# Altium project ESP32_eksperiment.PrjPcb
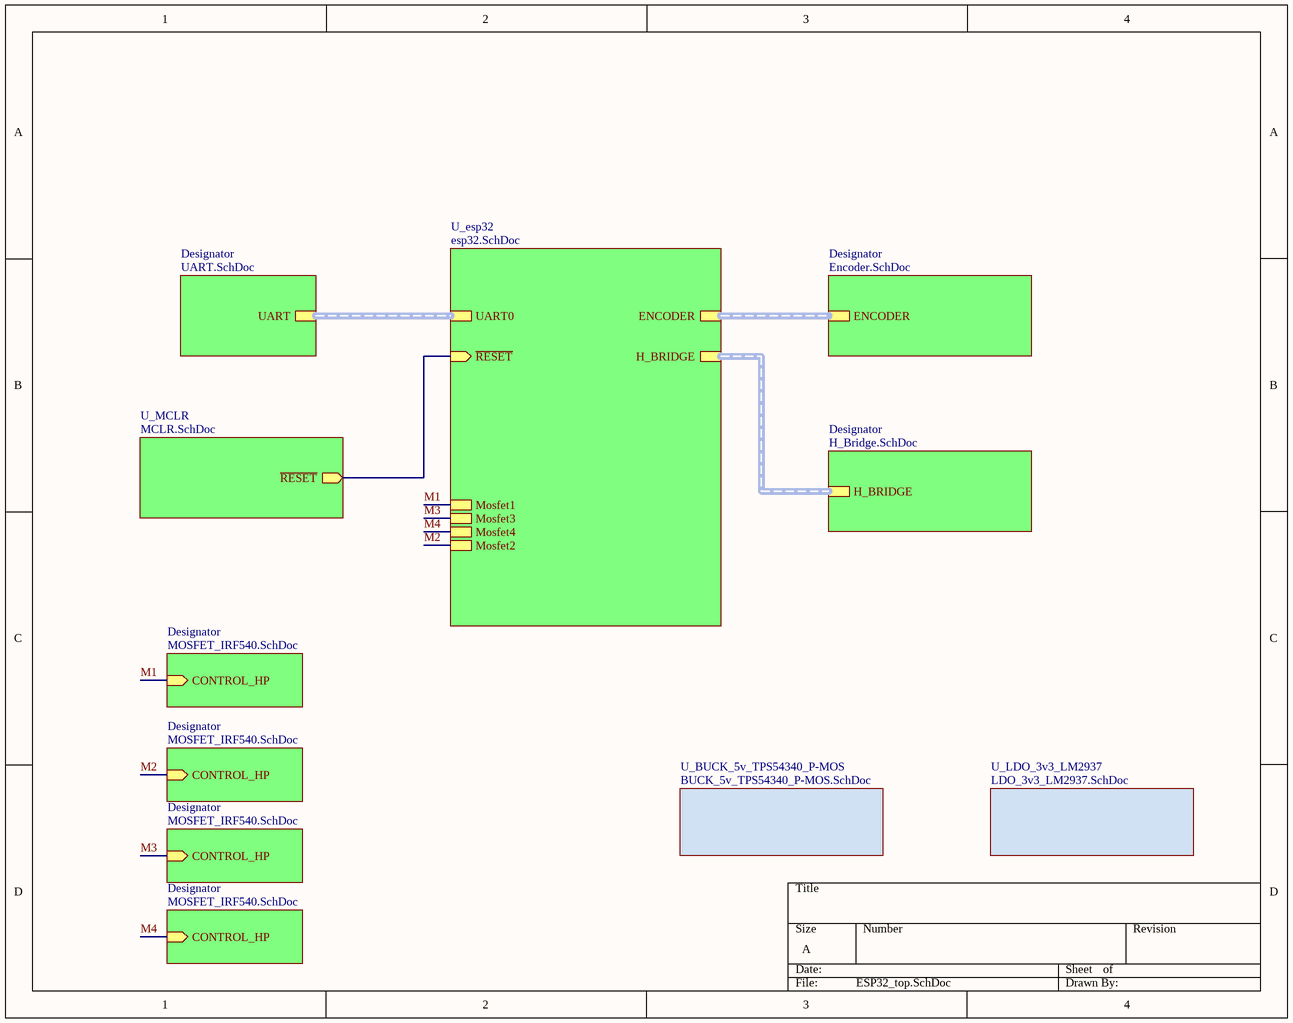
[diagram p0: ESP32_top.SchDoc]
9 sheets, 89 parts. Net scope: hierarchical (ports join the sheet entries above them; power ports are global).
Sheets:
  ESP32_top.SchDoc
    Designator = UART.SchDoc
    U_MCLR = MCLR.SchDoc
    U_LDO_3v3_LM2937 = LDO_3v3_LM2937.SchDoc
    U_BUCK_5v_TPS54340_P-MOS = BUCK_5v_TPS54340_P-MOS.SchDoc
    U_esp32 = esp32.SchDoc
    Designator = Encoder.SchDoc
    Designator = H_Bridge.SchDoc
    Designator = MOSFET_IRF540.SchDoc
    Designator = MOSFET_IRF540.SchDoc
    Designator = MOSFET_IRF540.SchDoc
    Designator = MOSFET_IRF540.SchDoc

## Sheet ESP32_top.SchDoc
size A; SheetNumber: 1; SheetTotal: 9

### Sub-sheets
Designator = UART.SchDoc: UART (harness Conn.UART)
Designator = Encoder.SchDoc: ENCODER (harness conn. encoder)
Designator = H_Bridge.SchDoc: H_BRIDGE (harness conn.h_bridge)
Designator = MOSFET_IRF540.SchDoc: CONTROL_HP (in)
Designator = MOSFET_IRF540.SchDoc: CONTROL_HP (in)
Designator = MOSFET_IRF540.SchDoc: CONTROL_HP (in)
Designator = MOSFET_IRF540.SchDoc: CONTROL_HP (in)
U_BUCK_5v_TPS54340_P-MOS = BUCK_5v_TPS54340_P-MOS.SchDoc: no entries
U_esp32 = esp32.SchDoc: UART0 (harness esp.32 UART), ENCODER (harness esp32. encoder), ~{RESET} (in), H_BRIDGE (harness esp32. h_bridge), Mosfet1, Mosfet3, Mosfet4, Mosfet2
U_LDO_3v3_LM2937 = LDO_3v3_LM2937.SchDoc: no entries
U_MCLR = MCLR.SchDoc: ~{RESET} (out)

### Nets
M1: sheet U_esp32/Mosfet1, sheet Designator/CONTROL_HP
M2: sheet U_esp32/Mosfet2, sheet Designator/CONTROL_HP
M3: sheet U_esp32/Mosfet3, sheet Designator/CONTROL_HP
M4: sheet U_esp32/Mosfet4, sheet Designator/CONTROL_HP
Net?_3: sheet U_MCLR/~{RESET}, sheet U_esp32/~{RESET}

### Buses and harness runs
harness sheet Designator/ENCODER = sheet U_esp32/ENCODER
harness sheet Designator/H_BRIDGE = sheet U_esp32/H_BRIDGE
harness sheet Designator/UART = sheet U_esp32/UART0

## Sheet UART.SchDoc
size A; SheetNumber: 7; SheetTotal: 9
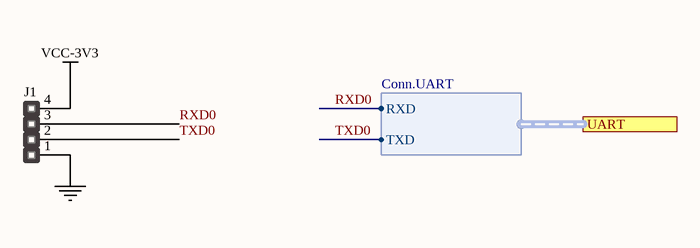
[diagram p1: UART.SchDoc]

### Parts
J1  HEADER_1x4  [HM1X4]  (value not drawn)

### Ports
UART (harness Conn.UART)

### Harnesses
Conn.UART: RXD, TXD

### Nets
GND: J1.1
VCC-3V3: J1.4
RXD0: J1.3 ; port UART.RXD  [project net RXD]
TXD0: J1.2 ; port UART.TXD  [project net TXD]

## Sheet MCLR.SchDoc
size A; SheetNumber: 3; SheetTotal: 7
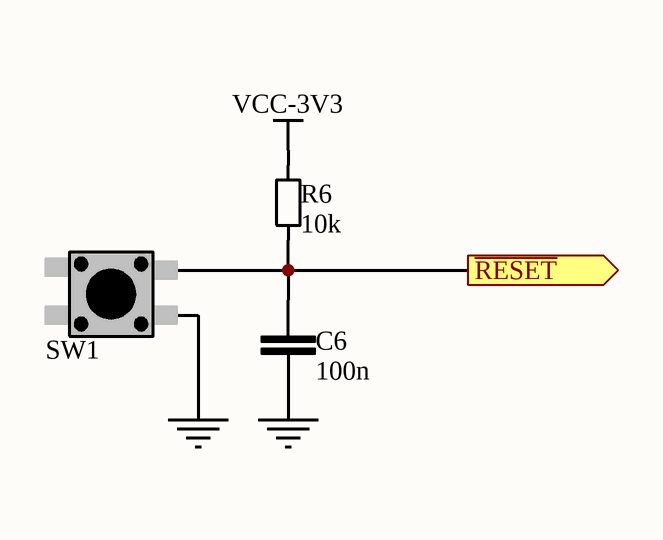
[diagram p2: MCLR.SchDoc]

### Parts
C6  100n  [CER_0603]
R6  10k  [RESC2013X38N-0805-NOOVERLAY]
SW1  TASTER  [TASTER_SMD]  (value not drawn)

### Ports
~{RESET} (out)

### Nets
GND: C6.1 SW1.1
VCC-3V3: R6.2
Net?_3: C6.2 R6.1 SW1.2 ; port ~{RESET}

### Library data of the parts
C6 = 06032105: CAP CER 100n 10V X5R 10% 0603; Capacitance: 100n
R6 = 000001002: RES SMD 10 kOhm 1/8W 0805; Resistance: 10k

## Sheet LDO_3v3_LM2937.SchDoc
size A; SheetNumber: 2; SheetTotal: 6
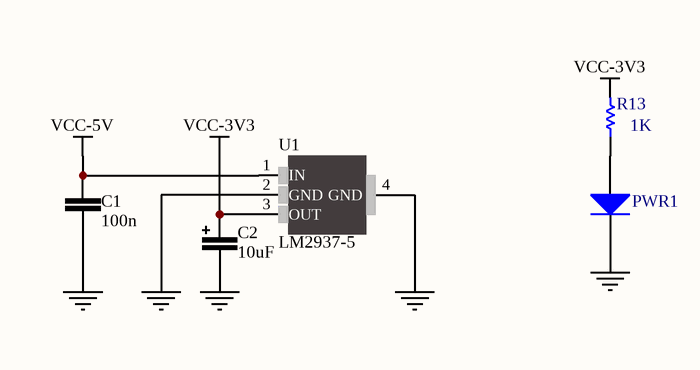
[diagram p3: LDO_3v3_LM2937.SchDoc]

### Parts
C1  100n  [CER_0603]
C2  10uF  [TANT_1210]
PWR1  (no value)  [SMC]
R13  value 1K  [AXIAL-0.3]
U1  LM2937-5  [SOT223]

### Nets
GND: C1.1 C2.2 PWR1.2(K) U1.2(GND) U1.4(GND)
VCC-3V3: C2.1 U1.3(OUT)
VCC-5V: C1.2 U1.1(IN)
NetPWR1_1: PWR1.1(A) R13.1

Not connected (* = marked no-connect by the designer): R13 2

### Notes on the sheet
- Labels drawn without touching a wire or pin: VCC-3V3

### Library data of the parts
C1 = 06032105: CAP CER 100n 10V X5R 10% 0603; Capacitance: 100n
C2 = 00001106: CAP TANT 10u; Value: 10uF
PWR1 = Diode: Default Diode; Published: 8-Jun-2000; LatestRevisionDate: 17-Jul-2002; LatestRevisionNote: Re-released for DXP Platform.; PackageVersion: Sep-1996; PackageReference: SMC; Publisher: Altium Limited; PackageDescription: DO-214-AB/SMC; 2 C-Bend Leads; Body 7.9 x 5.9 mm, inc. leads (LxW); Code_JEDEC: DO-214-AB
R13 = Res1: Resistor; Published: 8-Jun-2000; LatestRevisionDate: 17-Jul-2002; LatestRevisionNote: Re-released for DXP Platform.; PackageReference: AXIAL-0.3; Publisher: Altium Limited; PackageDescription: Axial Device, Thru-Hole; 2 Leads; 0.3 in Pin Spacing
U1 = 00000007: IC REG LINEAR 5V 400MA SOT223-4; Manufacturer Part Number: LM2937-5; Datasheet Link: http://www.ti.com/lit/ds/symlink/lm2937.pdf

## Sheet BUCK_5v_TPS54340_P-MOS.SchDoc
size A; SheetNumber: 1; SheetTotal: 7
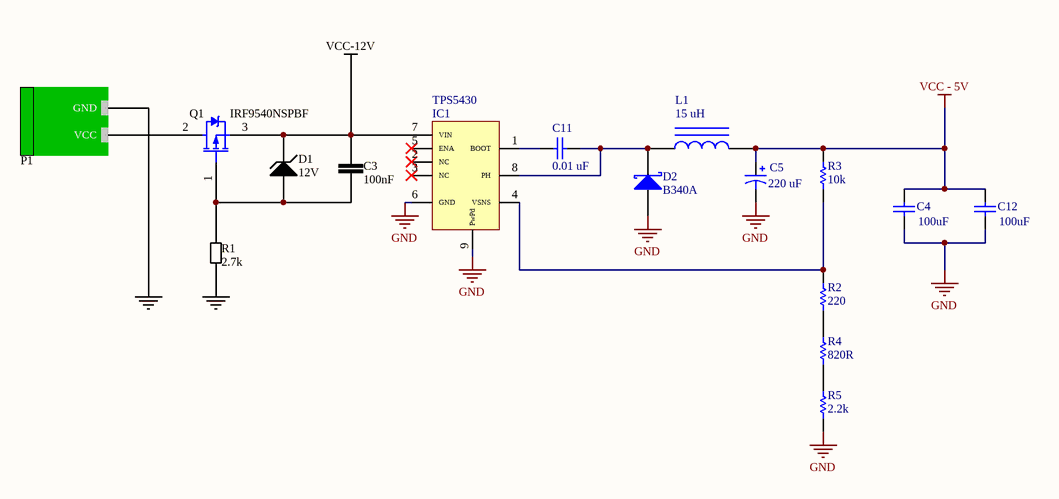
[diagram p4: BUCK_5v_TPS54340_P-MOS.SchDoc]

### Parts
C3  100nF  [CER_0805]
C4  value 100uF  [RAD-0.3]
C5  value 220 uF  [RB7.6-15]
C11  0.01 uF  [RAD-0.3]
C12  value 100uF  [RAD-0.3]
D1  12V  [DO214AC]
D2  B340A  [SMB]
IC1  TPS5430  [TPS5430]
L1  15 uH  [AXIAL-0.9]
P1  2EDGRC-5.08-02P-14-00A(H)  [PWR_Con]  (value not drawn)
Q1  IRF9540NSPBF  [D2PAK-2]
R1  2.7k  [RESC2013X38N-0805-NOOVERLAY]
R2  220  [AXIAL-0.3]
R3  10k  [AXIAL-0.3]
R4  value 820R  [AXIAL-0.3]
R5  value 2.2k  [AXIAL-0.3]

### Nets
GND: C4.1 C5.2 C12.1 D2.1(A) IC1.6(GND) IC1.9(PwPd) P1.1(GND) R1.1 R5.1
VCC - 5V: C4.2 C5.1 C12.2 L1.2 R3.2
VCC-12V: C3.2 D1.1(Cathode) IC1.7(VIN) Q1.3(S)
NetC3_1: C3.1 D1.2(Anode) Q1.1(G) R1.2
NetC11_1: C11.1 IC1.1(BOOT)
NetC11_2: C11.2 D2.2(K) IC1.8(PH) L1.1
NetIC1_4: IC1.4(VSNS) R2.2 R3.1
NetP1_2: P1.2(VCC) Q1.2(D)
NetR2_1: R2.1 R4.2
NetR4_1: R4.1 R5.2

Not connected (* = marked no-connect by the designer): IC1 2(NC)* 3(NC)* 5(ENA)*

### Library data of the parts
C3 = 00002105: CAP CER 100n 50V X7R 10% 0805; Capacitance: 100nF
C4 C11 C12 = Cap: Capacitor; Published: 8-Jun-2000; LatestRevisionDate: 17-Jul-2002; LatestRevisionNote: Re-released for DXP Platform.; PackageReference: RAD-0.3; Publisher: Altium Limited; PackageDescription: Radial Cap, Thru-Hole; 2 Leads; 0.3 in Pin Spacing
C5 = Cap Pol1: Polarized Capacitor (Radial); Published: 8-Jun-2000; LatestRevisionDate: 17-Jul-2002; LatestRevisionNote: Re-released for DXP Platform.; PackageReference: RB7.6-15; Publisher: Altium Limited; PackageDescription: Polarized Capacitor (Radial); 2 Leads
D1 = ZENER: DIODE ZENER; Manufacturer: Vishay Semiconductor Diodes Division; Manufacturer Part Number: B360B; Barcode: 0100000007488; id: 62; Assembly: SMD; Speed: Fast Recovery =< 500ns, > 200mA (Io); Voltage  DC Reverse: 60V; Current  Average Rectified: 3A; Voltage  Forward: 550mV @ 3A; Diode Type: Schottky; item_id: 1025; Recommended Rating: Silver; Category: Discrete Semiconductor Products; Datasheet URL: http://www.vishay.com/docs/88896/b330la.pdf; Package Case: DO-214AC, SMA; Family: DIODE; Part Type: Discrete Semiconductors; Refferent Voltage: 12V
D2 = D Schottky: Schottky Diode; Published: 8-Jun-2000; LatestRevisionDate: 17-Jul-2002; LatestRevisionNote: Re-released for DXP Platform.; PackageReference: SMB; Publisher: Altium Limited; PackageDescription: DO-214-AA/SMB; 2 C-Bend Leads; Body 5.3 x 3.6 mm, inc. leads (LxW); Code_JEDEC: DO-214-AA
IC1 = TPS543?: Part Number: TPS5430; Parameter 2: *
L1 = Inductor Iron: Magnetic-Core Inductor; Published: 24-Mar-1999; LatestRevisionDate: 17-Jul-2002; LatestRevisionNote: Re-released for DXP Platform.; PackageReference: AXIAL-0.9; Publisher: Altium Limited; PackageDescription: Axial Device, Thru-Hole; 2 Leads; 0.9 in Pin Spacing
P1 = 00000002: TERM BLOCK HDR 2POS 90DEG 5.08MM; Suplier: TME; Manufacturer Part Number: 2EDGRC-5.08-02P-14-00A(H); Suplier Product Link: https://www.tme.eu/en/details/2edgrc5.08-2p14/pluggable-terminal-blocks/degson-electronics/2edgrc-508-02p-14-00ah/; Price: 0.1304
Q1 = IRF9540N: P-MOS; Manufacturer: INTERNATIONAL RECTIFIER; Manufacturer Part Number: IRF9540NSPBF; Order Code: IRF9540NS; Package: TO-263 SMD; Price: DIN 62.54; Supplier: Comet.rs
R1 = 00002701: RES SMD 2.7 kOhm 1/8W 0805; Power: 0.125W, 1/8W; Barcode: 00004701; Resistance: 2.7k; Assembly: SMD
R2-R5 = Res1: Resistor; Published: 8-Jun-2000; LatestRevisionDate: 17-Jul-2002; LatestRevisionNote: Re-released for DXP Platform.; PackageReference: AXIAL-0.3; Publisher: Altium Limited; PackageDescription: Axial Device, Thru-Hole; 2 Leads; 0.3 in Pin Spacing

## Sheet esp32.SchDoc
size A; SheetNumber: 8; SheetTotal: 9
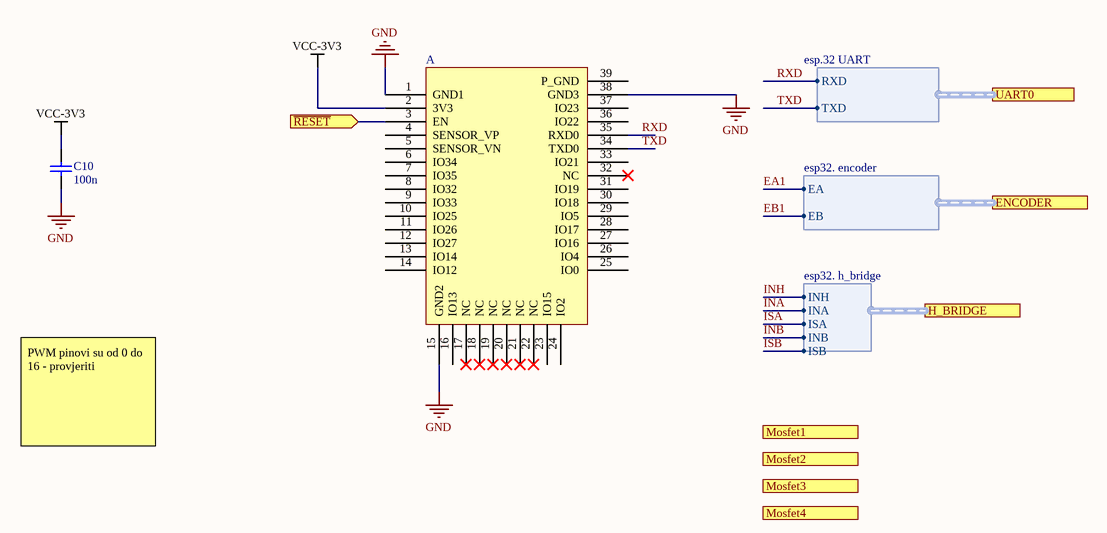
[diagram p5: esp32.SchDoc]

### Parts
?  (no value)  (part A of 3)
C10  value 100n  [RAD-0.3]

### Ports
ENCODER (harness esp32. encoder), H_BRIDGE (harness esp32. h_bridge), Mosfet1, Mosfet2, Mosfet3, Mosfet4, UART0 (harness esp.32 UART), ~{RESET} (in)

### Harnesses
esp.32 UART: RXD, TXD
esp32. encoder: EA, EB
esp32. h_bridge: INH, INA, ISA, INB, ISB

### Nets
GND: ?.1(GND1) ?.15(GND2) ?.38(GND3) C10.1
VCC-3V3: ?.2(3V3) C10.2
RXD: ?.35(RXD0) ; port UART0.RXD
TXD: ?.34(TXD0) ; port UART0.TXD
Net?_3: ?.3(EN) ; port ~{RESET}

Not connected (* = marked no-connect by the designer): ? 4(SENSOR_VP) 5(SENSOR_VN) 6(IO34) 7(IO35) 8(IO32) 9(IO33) 10(IO25) 11(IO26) 12(IO27) 13(IO14) 14(IO12) 16(IO13) 17(NC)* 18(NC)* 19(NC)* 20(NC)* 21(NC)* 22(NC)* 23(IO15) 24(IO2) 25(IO0) 26(IO4) 27(IO16) 28(IO17) 29(IO5) 30(IO18) 31(IO19) 32(NC)* 33(IO21) 36(IO22) 37(IO23) 39(P_GND)

### Notes on the sheet
- PWM pinovi su od 0 do 16 - provjeriti

### Library data of the parts
? = Component_1
C10 = Cap: Capacitor; Published: 8-Jun-2000; LatestRevisionDate: 17-Jul-2002; LatestRevisionNote: Re-released for DXP Platform.; PackageReference: RAD-0.3; Publisher: Altium Limited; PackageDescription: Radial Cap, Thru-Hole; 2 Leads; 0.3 in Pin Spacing

## Sheet Encoder.SchDoc
size A; SheetNumber: 6; SheetTotal: 9
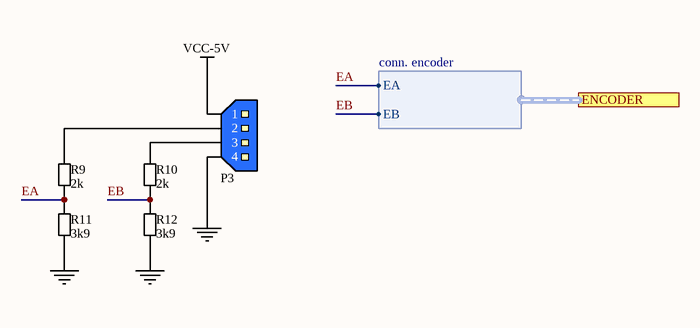
[diagram p6: Encoder.SchDoc]

### Parts
P3  TE CONNECTIVITY_4PIN_MALE  [TE CONNECTIVITY_4PIN_MALE]  (value not drawn)
R9  2k  [RESC2013X38N-0805-NOOVERLAY]
R10  2k  [RESC2013X38N-0805-NOOVERLAY]
R11  3k9  [RESC2013X38N-0805-NOOVERLAY]
R12  3k9  [RESC2013X38N-0805-NOOVERLAY]

### Ports
ENCODER (harness conn. encoder)

### Harnesses
conn. encoder: EA, EB

### Nets
GND: P3.4 R11.1 R12.1
VCC-5V: P3.1
EA: R9.1 R11.2 ; port ENCODER.EA
EB: R10.1 R12.2 ; port ENCODER.EB
NetP3_2: P3.2 R9.2
NetP3_3: P3.3 R10.2

### Library data of the parts
P3 = TE CONNECTIVITY_4PIN_MALE: BLUE_4PIN_CONECTOR; Manufacturer: TE CONNECTIVITY / AMP; Manufacturer Part Number 1: 281695-3; Order Code 1: 1205983; Price 1: £0.403; Supplier 1: uk.farnell.com
R9 R10 = 00002001: RES SMD 2 kOhm 1/8W 0805; Power: 0.125W, 1/8W; Barcode: 00009101; Resistance: 2k; Assembly: SMD
R11 R12 = 00003901: RES SMD 3.9 kOhm 1/8W 0805; Power: 0.125W, 1/8W; Barcode: 00009101; Resistance: 3k9; Assembly: SMD

## Sheet H_Bridge.SchDoc
size A; SheetNumber: 9; SheetTotal: 9
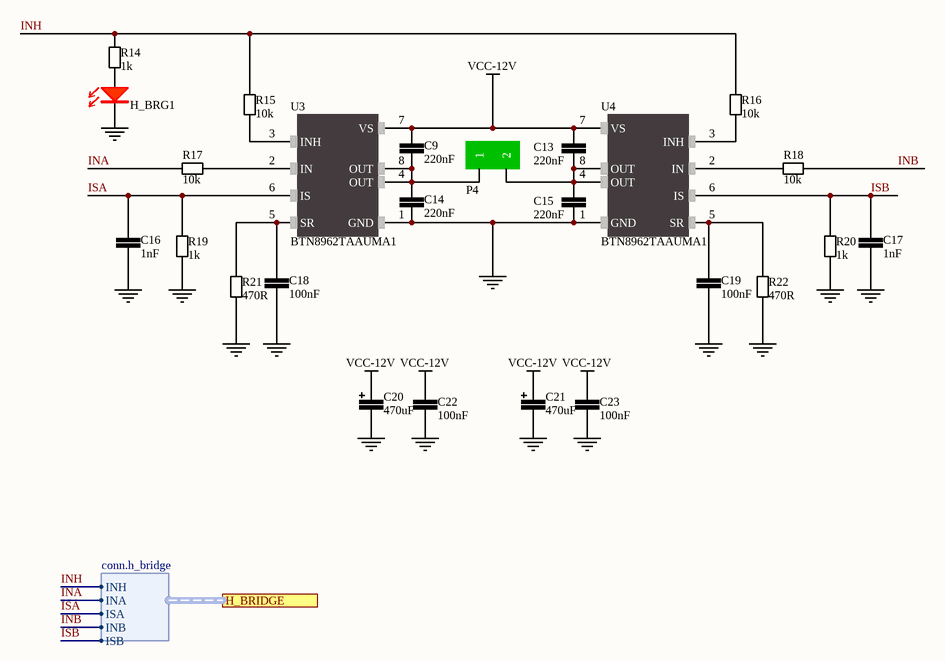
[diagram p7: H_Bridge.SchDoc]

### Parts
C9  220nF  [CER_0805]
C13  220nF  [CER_0805]
C14  220nF  [CER_0805]
C15  220nF  [CER_0805]
C16  1nF  [CER_0805]
C17  1nF  [CER_0805]
C18  100nF  [CER_0805]
C19  100nF  [CER_0805]
C20  470uF  [CAP10X20_RADIAL]
C21  470uF  [CAP10X20_RADIAL]
C22  100nF  [CER_0805]
C23  100nF  [CER_0805]
H_BRG1  LED RED  [LED_RED_0805]  (value not drawn)
P4  *  [MOTOR_CON]  (value not drawn)
R14  1k  [RESC2013X38N-0805-NOOVERLAY]
R15  10k  [RESC2013X38N-0805-NOOVERLAY]
R16  10k  [RESC2013X38N-0805-NOOVERLAY]
R17  10k  [RESC2013X38N-0805-NOOVERLAY]
R18  10k  [RESC2013X38N-0805-NOOVERLAY]
R19  1k  [RESC2013X38N-0805-NOOVERLAY]
R20  1k  [RESC2013X38N-0805-NOOVERLAY]
R21  470R  [RESC2013X38N-0805-NOOVERLAY]
R22  470R  [RESC2013X38N-0805-NOOVERLAY]
U3  BTN8962TAAUMA1  [TO263-7]
U4  BTN8962TAAUMA1  [TO263-7]

### Ports
H_BRIDGE (harness conn.h_bridge)

### Harnesses
conn.h_bridge: INH, INA, ISA, INB, ISB

### Nets
GND: C14.1 C15.1 C16.1 C17.1 C18.1 C19.1 C20.2 C21.2 C22.1 C23.1 H_BRG1.1(C) R19.1 R20.1 R21.1 R22.1 U3.1(GND) U4.1(GND)
VCC-12V: C9.2 C13.1 C20.1 C21.1 C22.2 C23.2 U3.7(VS) U4.7(VS)
INA: R17.2 ; port H_BRIDGE.INA
INB: R18.2 ; port H_BRIDGE.INB
INH: R14.2 R15.2 R16.2 ; port H_BRIDGE.INH
ISA: C16.2 R19.2 U3.6(IS) ; port H_BRIDGE.ISA
ISB: C17.2 R20.2 U4.6(IS) ; port H_BRIDGE.ISB
NetC9_1: C9.1 C14.2 P4.1 U3.4(OUT) U3.8(OUT)
NetC13_2: C13.2 C15.2 P4.2 U4.4(OUT) U4.8(OUT)
NetC18_2: C18.2 R21.2 U3.5(SR)
NetC19_2: C19.2 R22.2 U4.5(SR)
NetH_BRG1_2: H_BRG1.2(A) R14.1
NetR15_1: R15.1 U3.3(INH)
NetR16_1: R16.1 U4.3(INH)
NetR17_1: R17.1 U3.2(IN)
NetR18_1: R18.1 U4.2(IN)

### Library data of the parts
C9 C13-C15 = 00002205: CAP CER 220n 10V X5R 10% 0805; Capacitance: 220nF
C16 C17 = 00002105_1: CAP CER 1n 50V X7R 10% 0805; Capacitance: 1nF
C18 C19 C22 C23 = 00002105: CAP CER 100n 50V X7R 10% 0805; Capacitance: 100nF
C20 C21 = 00004707: CAP ALU 470u 25V 20%; Capacitance: 470uF
H_BRG1 = LED_RED_0805: LED RED 0805; Manufacturer: BRIGHT LED ELECTRONICS; Manufacturer Part Number: BL-HUB35A-AV-TRB; Barcode: 2911010024321; id: 35; Assembly: SMD; Voltage Forward: 2.0 V; item_id: 3341; Recommended Rating: Platinum; Package Case: 0805 (2012 Metric); Color: Red; Family: LED; Part Type: Optoelectronics
P4 = MOT_CONN: CONNECTOR FOR MOTOR OUTPUT; Manufacturer Part Number: *
R14 R19 R20 = 00001001: RES SMD 1 kOhm 1/8W 0805; Power: 0.125W, 1/8W; Barcode: 00009101; Resistance: 1k; Assembly: SMD
R15-R18 = 000001002: RES SMD 10 kOhm 1/8W 0805; Resistance: 10k
R21 R22 = 00004700: RES SMD 470 Ohm 1/8W 0805; Power: 0.125W, 1/8W; Barcode: 00006200; Resistance: 470R; Assembly: SMD
U3 U4 = 00000010: IC MOTOR DRIVER PAR TO263-7; Manufacturer Part Number: BTN8962TAAUMA1

## Sheet MOSFET_IRF540.SchDoc
size A; SheetNumber: 4; SheetTotal: 7
Used 4 times, as channels Designator, Designator, Designator, Designator. Parts and nets are listed once, with the designators drawn on the sheet.
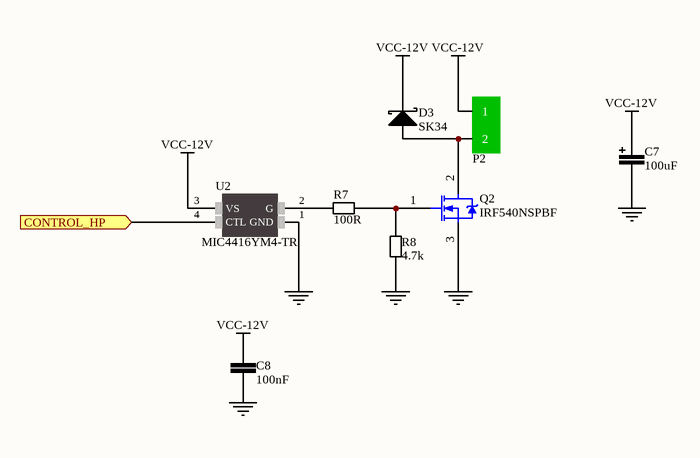
[diagram p8: MOSFET_IRF540.SchDoc]

### Parts
C7  100uF  [CAP5X11_RADIAL]
C8  100nF  [CER_0805]
D3  SK34  [DO214AC]
P2  DRV_B3  [MOTOR_CON]  (value not drawn)
Q2  IRF540NSPBF  [D2PAK-2]
R7  100R  [RESC2013X38N-0805-NOOVERLAY]
R8  4.7k  [RESC2013X38N-0805-NOOVERLAY]
U2  MIC4416YM4-TR  [SOT143-4]

### Ports
CONTROL_HP (in)

### Nets
GND: C7.2 C8.1 Q2.3(S) R8.1 U2.1(GND)
VCC-12V: C7.1 C8.2 D3.1(Cathode) P2.1 U2.3(VS)
CONTROL_HP: U2.4(CTL) ; port CONTROL_HP
NetD3_2: D3.2(Anode) P2.2 Q2.2(D)
NetQ2_1: Q2.1(G) R7.2 R8.2
NetR7_1: R7.1 U2.2(G)

### Channels
Designator: designators end in _Designator#1; ports CONTROL_HP=M1
Designator: designators end in _Designator#2; ports CONTROL_HP=M2
Designator: designators end in _Designator#3; ports CONTROL_HP=M3
Designator: designators end in _Designator#4; ports CONTROL_HP=M4

### Library data of the parts
C7 = 00004704: CAP ALU 4.7u 25V 20%; Capacitance: 100uF
C8 = 00002105: CAP CER 100n 50V X7R 10% 0805; Capacitance: 100nF
D3 = SK34: DIODE SCHOTTKY 40V 3A DO214AC; Manufacturer: Vishay Semiconductor Diodes Division; Barcode: 0100000007488; id: 62; Assembly: SMD; Speed: Fast Recovery =< 500ns, > 200mA (Io); Voltage  Forward: 550mV @ 3A; item_id: 1025; Recommended Rating: Silver; Manufacturer Part Number: SK34; Category: Discrete Semiconductor Products; Datasheet URL: http://www.vishay.com/docs/88896/b330la.pdf; Package Case: DO-214AC, SMA; Family: DIODE; Voltage  DC Reverse: 40V; Current  Average Rectified: 3A; Diode Type: Schottky; Part Type: Discrete Semiconductors
P2 = MOT_CONN: CONNECTOR FOR MOTOR OUTPUT; Manufacturer Part Number: *
Q2 = IRF540N: N-MOS; Manufacturer: INTERNATIONAL RECTIFIER; Manufacturer Part Number: IRF540NSPBF; Order Code: IRF540NS; Package: TO-263 SMD; Price: DIN 62.54; Supplier: Comet.rs
R7 = 00001000: RES SMD 100 Ohm 1/8W 0805; Power: 0.125W, 1/8W; Resistance: 100R; Assembly: SMD; Barcode: 00001000
R8 = 00004701: RES SMD 4.7 kOhm 1/8W 0805; Power: 0.125W, 1/8W; Resistance: 4.7k; Assembly: SMD; Barcode: 00004701
U2 = MIC4416: IC DRIVER MOSF LOW SIDE SOT143-4; Assembly: SMD; Manufacturer Part Number: MIC4416YM4-TR; Datasheet Link: http://ww1.microchip.com/downloads/en/DeviceDoc/mic4416.pdf; Category: Integrated Circuits (ICs); Package: SOT-143; Family: MOSFET Driver; Product Page Farnell: http://uk.farnell.com/microchip/mic4416ym4-tr/driver-mosfet-low-side-smd-4416/dp/2510112

## Nets that join several sheets
GND: UART (J1.1), MCLR (C6.1 SW1.1), LDO_3v3_LM2937 (5 pins), BUCK_5v_TPS54340_P-MOS (9 pins), esp32 (?.1 ?.15 ?.38 C10.1), Encoder (P3.4 R11.1 R12.1), H_Bridge (17 pins), Designator (5 pins), Designator (5 pins), Designator (5 pins), Designator (5 pins)
VCC-3V3: UART (J1.4), MCLR (R6.2), LDO_3v3_LM2937 (C2.1 U1.3), esp32 (?.2 C10.2)
VCC-5V: LDO_3v3_LM2937 (C1.2 U1.1), Encoder (P3.1)
VCC-12V: BUCK_5v_TPS54340_P-MOS (C3.2 D1.1 IC1.7 Q1.3), H_Bridge (8 pins), Designator (5 pins), Designator (5 pins), Designator (5 pins), Designator (5 pins)
Net?_3: MCLR (C6.2 R6.1 SW1.2), esp32 (?.3)
RXD: UART (J1.3), esp32 (?.35)
TXD: UART (J1.2), esp32 (?.34)